# EasyEDA schematic SCH_Arduino Polo R6 CAN cluster_2022-01-02.json
TITLE: Arduino Polo 6R CAN Cluster; REV: 1.0; Date: 2022-01-02; Sheet: 1/1; Company: Doctor_Ned (SirCapybar)
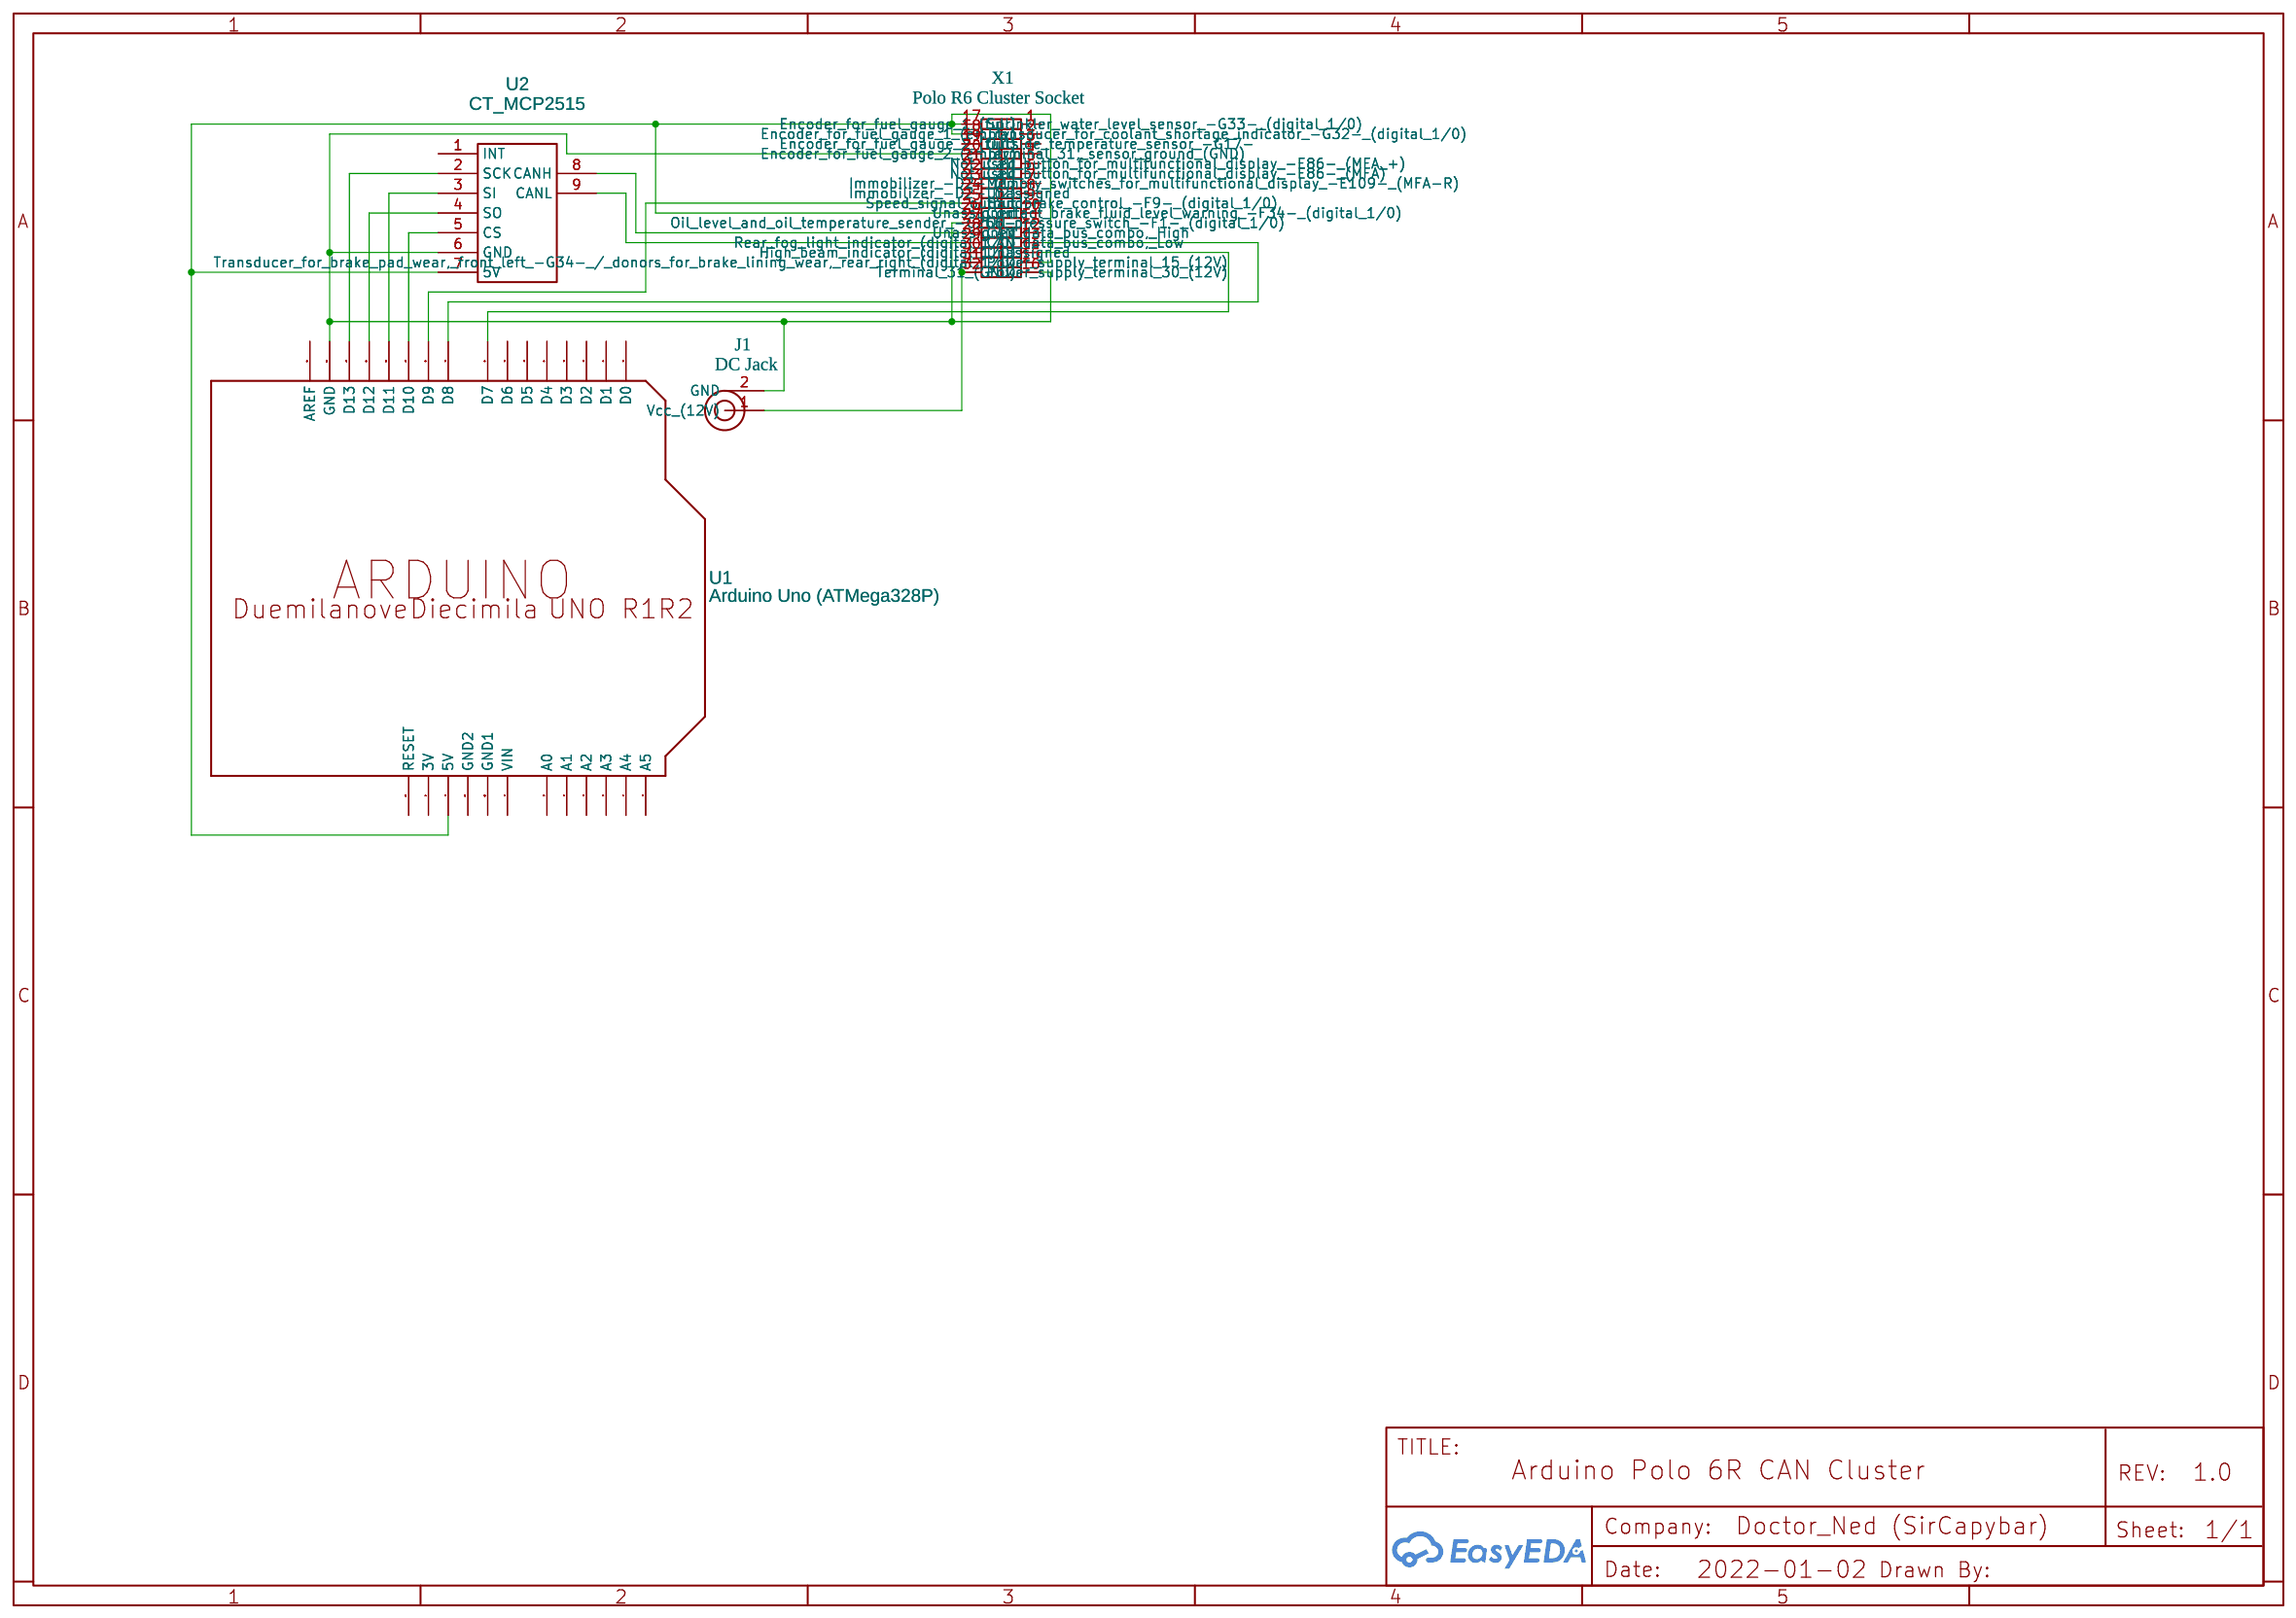
[diagram p0: schematic sheet]

## Parts
J1  DC Jack
U1  Arduino Uno (ATMega328P)  [ARDUINO]
U2  CT_MCP2515  [MCP2115]
X1  Polo R6 Cluster Socket

## Library data of the parts
U1 = ARDUINOUNO: Arduino DiecimilaDuemilanove; Contributor: Adafruit
U2 = CT_MCP2515: Contributor: ConceitoTeam

## Nets
Net-(J1-1): J1.1(Vcc (12V)) X1.31(Power supply terminal 15 (12V)) X1.32(Power supply terminal 30 (12V))
Net-(J1-2): J1.2(GND) U1.GND U2.6(GND) X1.16(Terminal 31 (GND)) X1.20(Terminal 31, sensor ground (GND)) X1.27(Oil pressure switch -F1- (digital 1/0))
Net-(U1-5V): U1.5V U2.7(5V) X1.15(Transducer for brake pad wear, front left -G34- / donors for brake lining wear, rear right (digital 1/0)) X1.17(Sprinkler water level sensor -G33- (digital 1/0)) X1.18(Transducer for coolant shortage indicator -G32- (digital 1/0)) X1.26(Contact brake fluid level warning -F34- (digital 1/0))
Net-(U1-D7): U1.D7 X1.14(High beam indicator (digital 1/0))
Net-(U1-D8): U1.D8 X1.13(Rear fog light indicator (digital 1/0))
Net-(U1-D9): U1.D9 X1.25(Handbrake control -F9- (digital 1/0))
Net-(U1-D10): U1.D10 U2.5(CS)
Net-(U1-D11): U1.D11 U2.3(SI)
Net-(U1-D12): U1.D12 U2.4(SO)
Net-(U1-D13): U1.D13 U2.2(SCK)
Net-(U2-8): U2.8(CANH) X1.28(CAN data bus combo, High)
Net-(U2-9): U2.9(CANL) X1.29(CAN data bus combo, Low)

Not connected (* = marked no-connect by the designer): U1 3V A0 A1 A2 A3 A4 A5 AREF D0 D1 D2 D3 D4 D5 D6 GND1 GND2 RESET VIN; U2 1(INT); X1 1(Encoder for fuel gauge 1 (full)) 2(Encoder for fuel gauge 1 (empty)) 3(Encoder for fuel gauge 2 (full)) 4(Encoder for fuel gauge 2 (empty)) 5(Not used) 6(Not used) 7(Immobilizer -D2- (1)) 8(Immobilizer -D2- (2)) 9(Speed signal output) 10(Unassigned) 11(Oil level and oil temperature sender -G266-) 12(Unassigned) 19(Outside temperature sensor -G17-) 21(Call button for multifunctional display -E86- (MFA +)) 22(Call button for multifunctional display -E86- (MFA)) 23(Memory switches for multifunctional display -E109- (MFA-R)) 24(Unassigned) 30(Unassigned)
